# Altium schematic sheet KSZ8863EthernetSwitch_RMII.SchDoc
size 420 x 297 mm; SheetNumber: 6; SheetTotal: 13
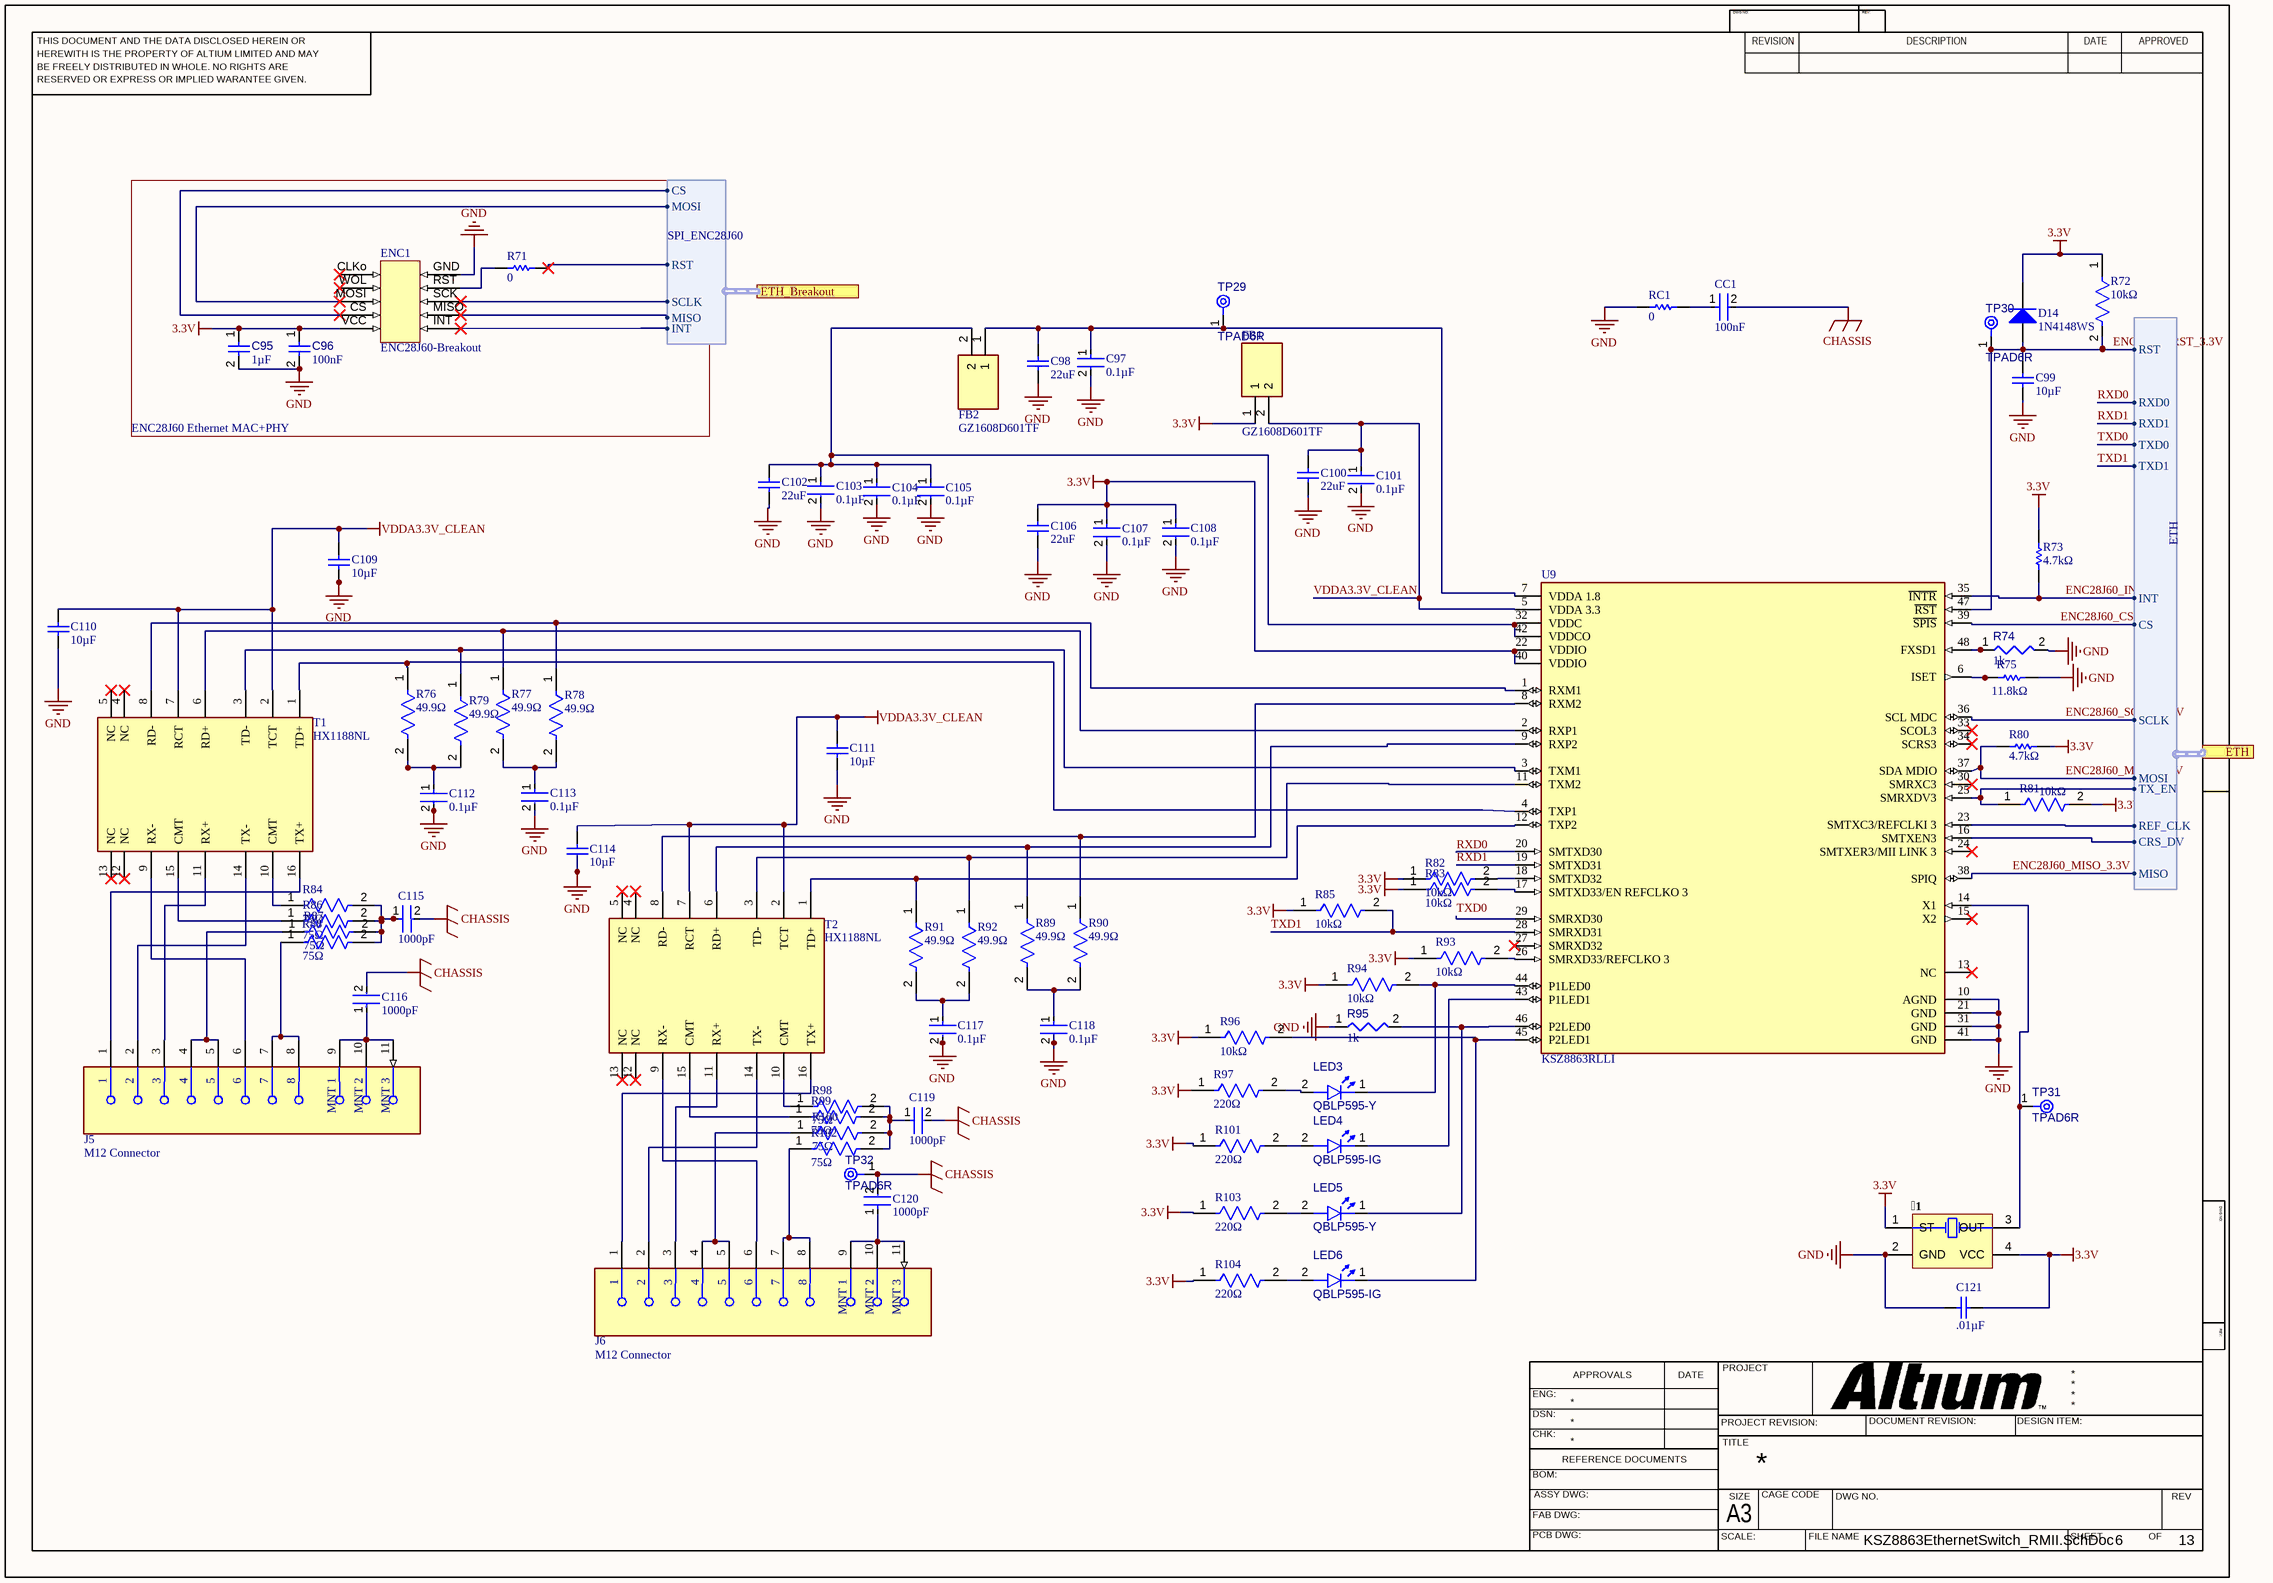
[diagram p0: KSZ8863EthernetSwitch_RMII.SchDoc]

## Parts
1  (no value)  [ABRA-ABM3B-4_V]
C95  value 1µF  [CAPC2013X135X45NL10T25]  (hidden comment: Capacitor 1 uF +/- 10% 50 V 0805)
C96  value 100nF  [CAPC2013X95X50LL10T25]  (hidden comment: Capacitor 100 nF +/-10% 50 V 0805)
C97  0.1µF  [FP-CC0402-MFG]
C98  22uF  [CAPC1210(3225)280_L]
C99  10µF  [CAPC1206(3216)190_L]
C100  22uF  [CAPC1210(3225)280_L]
C101  0.1µF  [FP-CC0402-MFG]
C102  22uF  [CAPC1210(3225)280_L]
C103  0.1µF  [FP-CC0402-MFG]
C104  0.1µF  [FP-CC0402-MFG]
C105  0.1µF  [FP-CC0402-MFG]
C106  22uF  [CAPC1210(3225)280_L]
C107  0.1µF  [FP-CC0402-MFG]
C108  0.1µF  [FP-CC0402-MFG]
C109  10µF  [CAPC1206(3216)190_L]
C110  10µF  [CAPC1206(3216)190_L]
C111  10µF  [CAPC1206(3216)190_L]
C112  0.1µF  [FP-CC0402-MFG]
C113  0.1µF  [FP-CC0402-MFG]
C114  10µF  [CAPC1206(3216)190_L]
C115  1000pF  [FP-C1206C-EF-MFG]
C116  1000pF  [FP-C1206C-EF-MFG]
C117  0.1µF  [FP-CC0402-MFG]
C118  0.1µF  [FP-CC0402-MFG]
C119  1000pF  [FP-C1206C-EF-MFG]
C120  1000pF  [FP-C1206C-EF-MFG]
C121  .01µF  [CAPC0603X33X15NL03T05]
CC1  100nF  [FP-1210-L_3_3_0_4-W_2_5_0-MFG]
D14  1N4148WS  [DIOD-SOD323-2-A_V]
ENC1  ENC28J60-Breakout  [New footprint 1]
FB1  GZ1608D601TF  [BEADC1608X95N]
FB2  GZ1608D601TF  [BEADC1608X95N]
J5  M12 Connector  [FP-1424177-MFG]
J6  M12 Connector  [FP-1424177-MFG]
LED3  QBLP595-Y  [QTB-QBLP595_V]
LED4  QBLP595-IG  [QTB-QBLP595_V]
LED5  QBLP595-Y  [QTB-QBLP595_V]
LED6  QBLP595-IG  [QTB-QBLP595_V]
R71  value 0  [RESC3216X60X45ML15T20]  (hidden comment: Resistor 0R +/- 5% 1206 250 mW)
R72  10kΩ  [FP-AC0603-MFG]
R73  4.7kΩ  [RESC2013X60X40ML20T25]
R74  value 1k  [RESC1608X55X25ML10T15]  (hidden comment: Resistor 1k +/-1% 0603 100 mW)
R75  11.8kΩ  [RESC2013X70X40NL20T20]
R76  49.9Ω  [FP-RT0603-MFG]
R77  49.9Ω  [FP-RT0603-MFG]
R78  49.9Ω  [FP-RT0603-MFG]
R79  49.9Ω  [FP-RT0603-MFG]
R80  4.7kΩ  [RESC2013X60X40ML20T25]
R81  10kΩ  [FP-AC0603-MFG]
R82  10kΩ  [FP-AC0603-MFG]
R83  10kΩ  [FP-AC0603-MFG]
R84  75Ω  [FP-RT0603-MFG]
R85  10kΩ  [FP-AC0603-MFG]
R86  75Ω  [FP-RT0603-MFG]
R87  75Ω  [FP-RT0603-MFG]
R88  75Ω  [FP-RT0603-MFG]
R89  49.9Ω  [FP-RT0603-MFG]
R90  49.9Ω  [FP-RT0603-MFG]
R91  49.9Ω  [FP-RT0603-MFG]
R92  49.9Ω  [FP-RT0603-MFG]
R93  10kΩ  [FP-AC0603-MFG]
R94  10kΩ  [FP-AC0603-MFG]
R95  value 1k  [RESC1608X55X25ML10T15]  (hidden comment: Resistor 1k +/-1% 0603 100 mW)
R96  10kΩ  [FP-AC0603-MFG]
R97  220Ω  [FP-RT0603-MFG]
R98  75Ω  [FP-RT0603-MFG]
R99  75Ω  [FP-RT0603-MFG]
R100  75Ω  [FP-RT0603-MFG]
R101  220Ω  [FP-RT0603-MFG]
R102  75Ω  [FP-RT0603-MFG]
R103  220Ω  [FP-RT0603-MFG]
R104  220Ω  [FP-RT0603-MFG]
RC1  value 0  [RESC2013X50X35ML15T15]  (hidden comment: Resistor 0R +/- 1% 0805 125 mW)
T1  HX1188NL  [FP-HX1188NL-MFG]
T2  HX1188NL  [FP-HX1188NL-MFG]
TP29  TPAD6R  [TP06R]  (no BOM)
TP30  TPAD6R  [TP06R]  (no BOM)
TP31  TPAD6R  [TP06R]  (no BOM)
TP32  TPAD6R  [TP06R]  (no BOM)
U9  KSZ8863RLLI  [FP-LQFP7x7-48LD-PL-1-IPC_B]

## Blocks framed on the sheet
ENC28J60 Ethernet MAC+PHY: C95 C96 ENC1 R71

## Ports
ETH (harness ETH), ETH_Breakout (harness SPI_ENC28J60)

## Harnesses
ETH: CS, SCLK, MOSI, MISO, INT, RST, TX_EN, REF_CLK, CRS_DV, RXD0, RXD1, TXD0, TXD1
SPI_ENC28J60: CS, MOSI, RST, SCLK, INT, MISO

## Nets
3.3V: 1.1(ST) 1.4(VCC) C95.1 C96.1 C106.2 C107.1 C108.1 C121.2 D14.2(K) ENC1.VCC FB1.1 R72.1 R73.2 R80.2 R81.2 R82.1 R83.1 R85.1 R93.1 R94.1 R96.1 R97.1 R101.1 R103.1 R104.1 U9.22(VDDIO) U9.40(VDDIO)
CHASSIS: C115.2 C116.2 C119.2 C120.2 CC1.2 TP32.1(TP)
GND: 1.2(GND) C95.2 C96.2 C97.2 C98.1 C99.1 C100.1 C101.2 C102.2 C103.2 C104.2 C105.2 C106.1 C107.2 C108.2 C109.1 C110.1 C111.1 C112.2 C113.2 C114.1 C117.2 C118.2 C121.1 ENC1.GND R74.2 R75.2 R95.1 RC1.1 U9.10(AGND) U9.21(GND) U9.31(GND) U9.41(GND)
VDDA3.3V_CLEAN: C100.2 C101.1 C109.2 C110.2 C111.2 C114.2 FB1.2 T1.2(TCT) T1.7(RCT) T2.2(TCT) T2.7(RCT) U9.5(VDDA_3.3)
ENC28J60_CS_3.3V: U9.39(~{SPIS})
ENC28J60_INT_3.3V: R73.1 U9.35(~{INTR})
ENC28J60_MISO_3.3V: U9.38(SPIQ)
ENC28J60_MOSI_3.3V: R80.1 U9.37(SDA_MDIO)
ENC28J60_RST_3.3V: C99.2 D14.1(A) R72.2 TP30.1(TP) U9.47(~{RST})
ENC28J60_SCLK_3.3V: U9.36(SCL_MDC)
RXD0: U9.20(SMTXD30) ; port ETH.RXD0
RXD1: U9.19(SMTXD31) ; port ETH.RXD1
TXD0: U9.29(SMRXD30) ; port ETH.TXD0
TXD1: R85.2 U9.28(SMRXD31) ; port ETH.TXD1
Net1_3: 1.3(OUT) TP31.1(TP) U9.14(X1)
NetC97_1: C97.1 C98.2 FB2.1 TP29.1(TP) U9.7(VDDA_1.8)
NetC102_1: C102.1 C103.1 C104.1 C105.1 FB2.2 U9.32(VDDC) U9.42(VDDCO)
NetC112_1: C112.1 R76.2 R79.2
NetC113_1: C113.1 R77.2 R78.2
NetC115_1: C115.1 R84.2 R86.2 R87.2 R88.2
NetC116_1: C116.1 J5.9(MNT_1) J5.10(MNT_2) J5.11(MNT_3)
NetC117_1: C117.1 R91.2 R92.2
NetC118_1: C118.1 R89.2 R90.2
NetC119_1: C119.1 R98.2 R99.2 R100.2 R102.2
NetC120_1: C120.1 J6.9(MNT_1) J6.10(MNT_2) J6.11(MNT_3)
NetCC1_1: CC1.1 RC1.2
NetENC1_CS: ENC1.CS ; port ETH_Breakout.CS
NetENC1_INT: ENC1.INT ; port ETH_Breakout.INT
NetENC1_MISO: ENC1.MISO ; port ETH_Breakout.MISO
NetENC1_MOSI: ENC1.MOSI ; port ETH_Breakout.MOSI
NetENC1_RST: ENC1.RST R71.1
NetJ5_1: J5.1 T1.16(TX+)
NetJ5_2: J5.2 T1.14(TX-)
NetJ5_3: J5.3 T1.11(RX+)
NetJ5_4: J5.4 J5.5 R87.1
NetJ5_6: J5.6 T1.9(RX-)
NetJ5_7: J5.7 J5.8 R88.1
NetJ6_1: J6.1 T2.16(TX+)
NetJ6_2: J6.2 T2.14(TX-)
NetJ6_3: J6.3 T2.11(RX+)
NetJ6_4: J6.4 J6.5 R100.1
NetJ6_6: J6.6 T2.9(RX-)
NetJ6_7: J6.7 J6.8 R102.1
NetLED3_1: LED3.1(K) R94.2 U9.44(P1LED0)
NetLED3_2: LED3.2(A) R97.2
NetLED4_1: LED4.1(K) U9.43(P1LED1)
NetLED4_2: LED4.2(A) R101.2
NetLED5_1: LED5.1(K) R95.2 U9.46(P2LED0)
NetLED5_2: LED5.2(A) R103.2
NetLED6_1: LED6.1(K) R96.2 U9.45(P2LED1)
NetLED6_2: LED6.2(A) R104.2
NetR71_2: R71.2 ; port ETH_Breakout.RST
NetR74_1: R74.1 U9.48(FXSD1)
NetR75_1: R75.1 U9.6(ISET)
NetR76_1: R76.1 T1.1(TD+) U9.4(TXP1)
NetR77_1: R77.1 T1.6(RD+) U9.2(RXP1)
NetR78_1: R78.1 T1.8(RD-) U9.1(RXM1)
NetR79_1: R79.1 T1.3(TD-) U9.3(TXM1)
NetR81_1: R81.1 U9.25(SMRXDV3) ; port ETH.TX_EN
NetR82_2: R82.2 U9.18(SMTXD32)
NetR83_2: R83.2 U9.17(SMTXD33/EN_REFCLKO_3)
NetR84_1: R84.1 T1.10(CMT)
NetR86_1: R86.1 T1.15(CMT)
NetR89_1: R89.1 T2.6(RD+) U9.9(RXP2)
NetR90_1: R90.1 T2.8(RD-) U9.8(RXM2)
NetR91_1: R91.1 T2.1(TD+) U9.12(TXP2)
NetR92_1: R92.1 T2.3(TD-) U9.11(TXM2)
NetR93_2: R93.2 U9.26(SMRXD33/REFCLKO_3)
NetR98_1: R98.1 T2.10(CMT)
NetR99_1: R99.1 T2.15(CMT)
NetU9_16: U9.16(SMTXEN3) ; port ETH.CRS_DV
NetU9_23: U9.23(SMTXC3/REFCLKI_3) ; port ETH.REF_CLK

Not connected (* = marked no-connect by the designer): ENC1 CLKo* SCK* WOL*; T1 4(NC)* 5(NC)* 12(NC)* 13(NC)*; T2 4(NC)* 5(NC)* 12(NC)* 13(NC)*; U9 13(NC)* 15(X2)* 24(SMTXER3/MII_LINK_3)* 27(SMRXD32)* 30(SMRXC3)* 33(SCOL3)* 34(SCRS3)*

## Notes on the sheet
- THIS DOCUMENT AND THE DATA DISCLOSED HEREIN OR
- HEREWITH IS THE PROPERTY OF ALTIUM LIMITED AND MAY
- DWG NO:
- REVISION
- REV:
- DESCRIPTION
- DATE
- APPROVED
- BE FREELY DISTRIBUTED IN WHOLE. NO RIGHTS ARE
- RESERVED OR EXPRESS OR IMPLIED WARANTEE GIVEN.
- ENG:
- APPROVALS
- PROJECT
- DSN:
- CHK:
- REFERENCE DOCUMENTS
- PROJECT REVISION:
- TITLE
- DOCUMENT REVISION:
- DESIGN ITEM:
- BOM:
- FAB DWG:
- PCB DWG:
- ASSY DWG:
- SCALE:
- A3
- SIZE
- CAGE CODE
- FILE NAME
- DWG NO.
- SHEET
- OF
- REV

## Library data of the parts
1 = CMP-003-00019-2: Ceramic SMD Crystal, 24 MHz, +/- 20 ppm, 18 pF, -20 to 70 degC, 4-Pin SMD, RoHS, Tape and Reel; Manufacturer: Abracon; Load Capacitance: 18pF; Frequency Tolerance: 20ppm; ESR: 50; Resistance: 50Ohm; Frequency: 24MHz; Package Quantity: 1000; Packaging: TapeandReel; RoHS Compliant: True; Package Description: 4-Pin Surface Mount Device, Body 5 x 3.2 mm; Mounting Technology: SM; Pins: 4; Datasheet URL: http://www.abracon.com/Resonators/abm3b.pdf; Tolerance: 20ppm; Manufacturer URL: http://www.abracon.com/; Max Operating Temperature: 70°C; Datasheet Version: Aug-15; Min Operating Temperature: -20°C; Package Reference: ABM3B; Case/Package: CSMD
C95 = CMP-001-00007-6: Chip Capacitor, 1 uF, +/- 10%, 50 V, 0805 (2012 Metric); Capacitor Type: Ceramic; Voltage Rating: 50V; Case/Package: 0805; Max Operating Temperature: 125°C; Min Operating Temperature: -55°C; Mounting Technology: SM; Pins: 2; RoHS Compliant: True; Tolerance: 10%
C96 = CMP-001-00018-6: Chip Capacitor, 100 nF, +/- 10%, 50 V, 0805 (2012 Metric); Capacitor Type: Ceramic; Voltage Rating: 50V; Case/Package: 0805; Max Operating Temperature: 125°C; Min Operating Temperature: -55°C; Mounting Technology: SM; Pins: 2; RoHS Compliant: True; Tolerance: 10%
C97 C101 C103-C105 C107 C108 C112 C113 C117 C118 = CMP-03422-000748-1: CAP CER 0.1UF 10V X7R 0402; Manufacturer: YAGEO; Manufacturer Part Number: CC0402KRX7R6BB104; Tolerance: 0.1; Value: 100 nF; Temperature Coefficient: 30ppm/°C; Material: Ceramic; Automotive Grade: NA; Ipc Land Pattern Name: CAPC10050X50; Temperature Range Low: -55°C; Temperature: -55°C to +125°C; Footprint Url: http://www.yageo.com/exep/pages/download/literatures/UPY-C_GEN_24.pdf; Device Class L2: Capacitors; ComponentLink2Description: Datasheet; Temperature Characteristic: X7R; Height: 0.55mm; Mouser Description: Multilayer Ceramic Capacitors MLCC - SMD/SMT 100nF 10V X7R 10%; Temperature Range High: +125°C; Package: CC0402; Digikey Description: CAP CER 0.1UF 10V X7R 0402; Automotive: No; Voltage Rating: 10 V; Octopart: https://octopart.com/cc0402krx7r6bb104-yageo-8376509; Capacitance: 100 nF; ComponentLink2URL: http://www.yageo.com/documents/recent/UPY-GP_NP0_16V-to-50V_16.pdf; Category: Cap; Lead Free: Yes; Device Class L3: Ceramic Capacitors; RoHS: TRUE; Device Class L1: Passive Components
C98 C100 C102 C106 = CMP-1038-02268-1: CAP 22uF 10V ±10% 1210 (3225 Metric) Thickness 2.8mm SMD; Case-Metric: 3225; Case-EIA: 1210; Tolerance: Â±10%; Max Thickness: 2.8 mm; Value: 22uF; Technology: SMT; Rated Voltage: 10 V
C99 C109-C111 C114 = CMP-1037-04967-1: CAP 10uF 10V ±10% 1206 (3216 Metric) Thickness 1.9mm SMD; Tolerance: Â±10%; Case-Metric: 3216; Case-EIA: 1206; Rated Voltage: 10 V; Max Thickness: 1.9 mm; Technology: SMT; Value: 10uF
C115 C116 C119 C120 = CMP-03020-034681-1: CAP CER 1000PF 2KV X7R 1206; Tolerance: 10%; Capacitance: 1nF; Dissipation Factor: 2.5%; Dielectric Material: Ceramic; Voltage Rating (DC): 2.5kV; Voltage: 2kV; REACH SVHC: No SVHC; Height: 1.6mm; Construction: Flat; Case/Package: 1206; Series: C; Mount: Surface Mount; RoHS Compliant: Yes; Package Quantity: 1; Length: 3.2mm; Width: 0.063inch; Voltage Rating: 2kV; Min Operating Temperature: -55°C; Case Code (Metric): 3216; Termination: SMD/SMT; Number of Pins: 2; Case Code (Imperial): 1206; Packaging: Tape and Reel; Dielectric: X7R; Thickness: 0.069inch; Depth: 1.6mm; Radiation Hardening: No; Max Operating Temperature: 125°C
C121 = CMP-2010-00236-1: Part Number: 0201ZD103KAT2A; Manufacturer: AVX Interconnect / Elco
CC1 = CMP-1038-01657-2: General Purpose Ceramic Capacitor, 1210, 100nF, 10%, X7R, +15%, 50V; Insulation Resistance: 100GR; Dissipation Factor: 2.5%; Number of Pins: 2; Max Operating Temperature: 125°C; Tolerance: 10%; Length: 3.2mm; Width: 0.098inch; Dielectric: X7R; Thickness: 0.037inch; Height: 0.94mm; Capacitance: 100nF; Voltage Rating: 50V; Voltage: 50V; Construction: Flat; Termination: SMD/SMT; Depth: 2.5mm; Mount: Surface Mount; Series: -; Min Operating Temperature: -55°C; Case Code (Imperial): 1210; Packaging: Tape and Reel; RoHS Compliant: Yes; Voltage Rating (DC): 50V; Case/Package: 1210; Package Quantity: 1; REACH SVHC: No SVHC; Case Code (Metric): 3225; Lead Free: Lead Free
D14 = CMP-004-00002-2: Fast Switching Diode, 75 V, 0.3 A, -65 to 150 degC, 2-Pin SOD323, RoHS, Tape and Reel; Manufacturer: Diodes Inc; Peak Reverse Current: 1uA; Max Surge Current: 2A; Elements: 1; Forward Current: 300mA; Recovery Time: 4ns; Forward Voltage: 1.25V; Datasheet Version: Rev. 25-2, 03/2016; Case/Package: SOD; Min Operating Temperature: -65°C; RoHS Compliant: True; Max Operating Temperature: 150°C; Manufacturer URL: http://www.diodes.com/; Pins: 2; Package Quantity: 3000; Datasheet URL: http://www.diodes.com/datasheets/ds30097.pdf; Packaging: TapeandReel; Package Description: 2-Pin Small Outline Diode, Body 1.7 x 1.3 mm; Mounting Technology: SM; Package Reference: SOD323-2
ENC1 = CMP-031-00007-1
FB1 FB2 = GZ1608D601TF: Ferrite Bead; Manufacturer_Name: SUNLORD; Datasheet Link: https://datasheet.lcsc.com/szlcsc/Sunlord-GZ1608D601TF_C1002.pdf; Height: 0.95mm; Manufacturer_Part_Number: GZ1608D601TF
J5 J6 = CMP-09396-000004-1: CONN RCPT FMALE 8POS GOLD SOLDER; Number of Positions: 8; Voltage Rating: 48V; Ratings: IP67; Current Rating: 500mA; Gender: Female; Wire/Cable Diameter: 6mm; Connector Type: Receptacle; Fastening Type: Twist; Packaging: Bulk; Housing Material: Zinc; Contact Plating: Gold; Lead Free: Lead Free; REACH SVHC: No SVHC; Orientation: Straight; Max Operating Temperature: 70°C; Mount: Panel; Number of Contacts: 8; Termination: Solder; Series: PLUSCON; Min Operating Temperature: -40°C; Thread Size: M12; Package Quantity: 20; Contact Gender: Female
LED3-LED6 = CMP-007-00041-3: Chip LED 0402, Green, 0.02 A, 3.1 to 3.7 V, -40 to 80 degC, 2-Pin SMD, RoHS, Tape and Reel; Case/Package: 0402; Colour: Green; Mounting Technology: SMT; Pins: 2; RoHS Compliant: Yes
R71 = CMP-009-00002-5: Chip Resistor, 0 Ohm, +/- 5%, 0.25 W, -55 to 155 degC, 1206 (3216 Metric); Voltage Rating: 200V; Power: 250mW; Tolerance: 5%; Min Operating Temperature: -55°C; Mounting Technology: SM; Max Operating Temperature: 155°C; Case/Package: 1206; RoHS Compliant: True; Pins: 2
R72 R81-R83 R85 R93 R94 R96 = CMP-2000-04818-3: RES 10KΩ 1.00% 0.1W 0603; Power Rating: 100mW; Tolerance: 1%; Resistance: 10kR; Voltage Rating: 50V; Temperature Coefficient: 100ppm/°C; Ratings: AEC-Q200; Case Code (Metric): 1608; Max Power Dissipation: 100mW; Height: 0.45mm; Package Quantity: 1; Max Operating Temperature: 155°C; Resistor Type: Thick Film; Depth: 0.8mm; RoHS Compliant: Yes; Min Operating Temperature: -55°C; Packaging: Tape and Reel; Number of Terminations: 2; Length: 1.6mm; Features: Moisture Resistant; Military Standard: Not; Case Code (Imperial): 0603; Size Code: 0603; Termination: SMD/SMT; Case/Package: 0603; Mount: Surface Mount; Width: 0.8mm; Lead Free: Lead Free; Series: AC; Construction: Rectangular
R73 R80 = CMP-2001-00644-1: Part Number: ERA6AEB472V; Manufacturer: Panasonic
R74 R95 = CMP-009-00014-5: Chip Resistor, 1 KOhm, +/-1%, 0.1 W, -55 to 155 degC, 0603 (1608 Metric); Voltage Rating: 50V; Power: 100mW; Tolerance: 1%; Mounting Technology: SM; Pins: 2; Case/Package: 0603; Min Operating Temperature: -55°C; RoHS Compliant: True; Max Operating Temperature: 155°C
R75 = CMP-2001-04399-1: Part Number: ERJ-6ENF1182V; Manufacturer: Panasonic
R76-R79 R89-R92 = CMP-2000-04466-2: RES SMD 49.9 OHM 0.1% 1/10W 0603; Manufacturer: Yageo; Manufacturer Part Number: RT0603BRD0749R9L; Voltage Rating: 75V; Temperature Coefficient: 25 ppm/°C; Tolerance: 0.001; Power Rating: 0.1W; Resistance: 49.9Ω; Mouser Description: Res Thin Film 0603 49.9 Ohm 0.1% 1/10W ±25ppm/°C Molded SMD SMD Paper T/R; Category: Res; RoHS: TRUE; Digikey Description: RES SMD 49.9 OHM 0.1% 1/10W 0603; Lead Free: Yes; ComponentLink2URL: http://www.yageo.com/documents/recent/PYu-RT_1-to-0.01_RoHS_L_9.pdf; Temperature Range High: +155°C; Footprint Url: http://www.yageo.com/exep/pages/download/literatures/PYu-R_Mount_10.pdf; Series: RT; Composition: Thin Film; Package: RT0603; Height: 0.55mm; Device Class L3: Chip SMD Resistors; Temperature Range Low: -55°C; Temperature: -55°C to +155°C; Value: 49.9Ω; Automotive: No; Ipc Land Pattern Name: RESC16080X45; Device Class L2: Resistors; Octopart: https://octopart.com/rt0603brd0749r9l-yageo-1274115; Device Class L1: Passive Components; ComponentLink2Description: Datasheet
R84 R86-R88 R98-R100 R102 = CMP-03412-022448-1: RES SMD 75 OHM 0.5% 1/10W 0603; Manufacturer Part Number: RT0603DRE0775RL; Manufacturer: Yageo; Temperature Coefficient: 50 ppm/°C; Power Rating: 0.1W; Tolerance: 0.005; Voltage Rating: 75V; Temperature Range Low: -55°C; ComponentLink2URL: http://www.yageo.com/documents/recent/PYu-RT_1-to-0.01_RoHS_L_9.pdf; Device Class L3: Chip SMD Resistors; Ipc Land Pattern Name: RESC16080X45; Temperature Range High: +155°C; Footprint Url: http://www.yageo.com/exep/pages/download/literatures/PYu-R_Mount_10.pdf; Device Class L2: Resistors; ComponentLink2Description: Datasheet; Category: Res; Temperature: -55°C to +155°C; Digikey Description: RES SMD 75 OHM 0.5% 1/10W 0603; Value: 75Ω; Composition: Thin Film; Resistance: 75Ω; Lead Free: Yes; Package: RT0603; Height: 0.55mm; RoHS: TRUE; Automotive: No; Series: RT; Octopart: https://octopart.com/rt0603dre0775rl-yageo-1170737; Device Class L1: Passive Components
R97 R101 R103 R104 = CMP-03412-006815-1: RES SMD 220 OHM 1% 1/10W 0603; Manufacturer Part Number: RT0603FRE07220RL; Manufacturer: Yageo; Temperature Coefficient: 50 ppm/°C; Tolerance: 0.01; Power Rating: 0.1W; Voltage Rating: 75V; RoHS: TRUE; ComponentLink2URL: http://www.yageo.com/documents/recent/PYu-RT_1-to-0.01_RoHS_L_9.pdf; Resistance: 220Ω; Digikey Description: RES SMD 220 OHM 1% 1/10W 0603; Height: 0.55mm; Composition: Thin Film; Octopart: https://octopart.com/rt0603fre07220rl-yageo-39861932; Temperature: -55°C to +155°C; Series: RT; Package: RT0603; Category: Res; Mouser Description: Thin Film Resistors 1/10W 220 ohm 1% 50ppm; ComponentLink2Description: Datasheet; Ipc Land Pattern Name: RESC16080X45; Temperature Range Low: -55°C; Lead Free: Yes; Device Class L2: Resistors; Footprint Url: http://www.yageo.com/exep/pages/download/literatures/PYu-R_Mount_10.pdf; Device Class L3: Chip SMD Resistors; Value: 220Ω; Device Class L1: Passive Components; Automotive: No; Temperature Range High: +155°C
RC1 = CMP-009-00001-5: Chip Resistor, 0 Ohm, +/- 1%, 125 mW, -55 to 155 degC, 0805 (2012 Metric); Voltage Rating: 150V; Power: 125mW; Mounting Technology: SM; Max Operating Temperature: 155°C; Case/Package: 0805; RoHS Compliant: True; Pins: 2; Min Operating Temperature: -55°C; Tolerance: 1%
T1 T2 = CMP-2000-05323-2: MODULE XFRMR SGL ETHR LAN 16SOIC; Turns Ratio: 1:1; Insertion Loss: -1dB; Isolation Voltage: 1.5kV; DC Resistance (DCR): 1.5R; Return Loss: -12dB; Shielding: Unshielded; Lead/Base Style: Gull Wing; Series: -; Depth: 9.53mm; Radiation Hardening: No; Height - Seated (Max): 6.22mm; Package Quantity: 40; Mount: Surface Mount; Width: 7.11mm; Lead Free: Lead Free; Number of Pins: 16; RoHS Compliant: Yes; Termination: SMD/SMT; Min Operating Temperature: -40°C; Packaging: Rail/Tube; Height: 5.97mm; Case/Package: Module; Max Operating Temperature: 85°C; Length: 12.7mm
TP29-TP32 = CMP-00028-00002-2: 0.6mm round; Pins: 1
U9 = CMP-06281-000067-1: IC ETHERNET SWITCH 3PORT 48-LQFP; Number of Transceivers: 3; Max Supply Current: 114mA; Nominal Supply Current: 85mA; Data Rate: 100Mbps; Min Supply Voltage: 1.71V; Supply Voltage-Nom: 3.3V; Max Supply Voltage: 3.465V; Interface: I2C; Min Operating Temperature: -40°C; Lead Free: Lead Free; Width: 7.1mm; Packaging: Tray; Mount: Surface Mount; Series: -; Radiation Hardening: No; Case/Package: LQFP; Number of Ports: 3; Height: 1.45mm; Length: 7.1mm; RoHS Compliant: Yes; Package Quantity: 250; Number of Functions: 3; Supply Current: 85mA; Number of Pins: 48; Max Operating Temperature: 85°C; REACH SVHC: No SVHC; Operating Supply Voltage: 3.3V